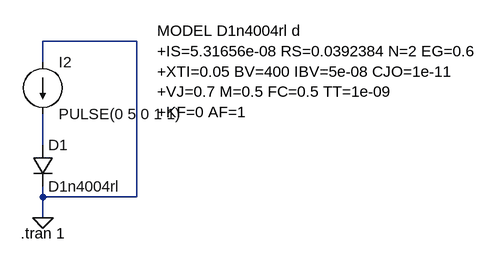
[diagram p0: schematic L4.asc]
L4.asc, the LTspice schematic file:
Version 4
SHEET 1 928 680
WIRE 352 64 208 64
WIRE 208 96 208 64
WIRE 208 224 208 176
WIRE 208 304 208 288
WIRE 352 304 352 64
WIRE 352 304 208 304
WIRE 208 336 208 304
FLAG 208 336 0
SYMBOL current 208 96 R0
WINDOW 123 0 0 Left 0
WINDOW 39 0 0 Left 0
SYMATTR InstName I2
SYMATTR Value PULSE(0 5 0 1 1)
SYMBOL diode 192 224 R0
SYMATTR InstName D1
SYMATTR Value D1n4004rl
TEXT 384 48 Left 2 !MODEL D1n4004rl d\n+IS=5.31656e-08 RS=0.0392384 N=2 EG=0.6\n+XTI=0.05 BV=400 IBV=5e-08 CJO=1e-11\n+VJ=0.7 M=0.5 FC=0.5 TT=1e-09\n+KF=0 AF=1
TEXT 174 360 Left 2 !.tran 1

The netlist it stands for:
* L4.asc
I2 0 N001 PULSE(0 5 0 1 1)
D1 N001 0 D1n4004rl
.model D D
.lib standard.dio
MODEL D1n4004rl d
+IS=5.31656e-08 RS=0.0392384 N=2 EG=0.6
+XTI=0.05 BV=400 IBV=5e-08 CJO=1e-11
+VJ=0.7 M=0.5 FC=0.5 TT=1e-09
+KF=0 AF=1
.tran 1
.backanno
.end